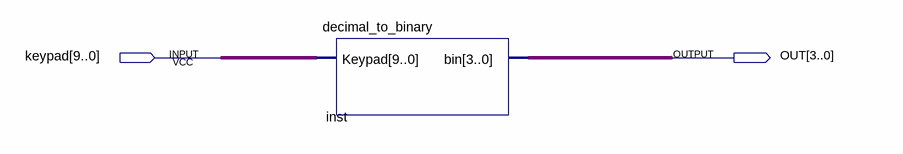
[diagram p0: schematic sheet]
// Quartus schematic week9_1.bdf as structural Verilog: 1 symbols, 2 pins
module week9_1 (
  input  [9:0] keypad,
  output [3:0] OUT
);

  decimal_to_binary inst (.Keypad(keypad), .bin(OUT));
endmodule
